# Altium schematic sheet I2C.SchDoc
size A; DocumentNumber: 1; SheetNumber: 1; SheetTotal: 1
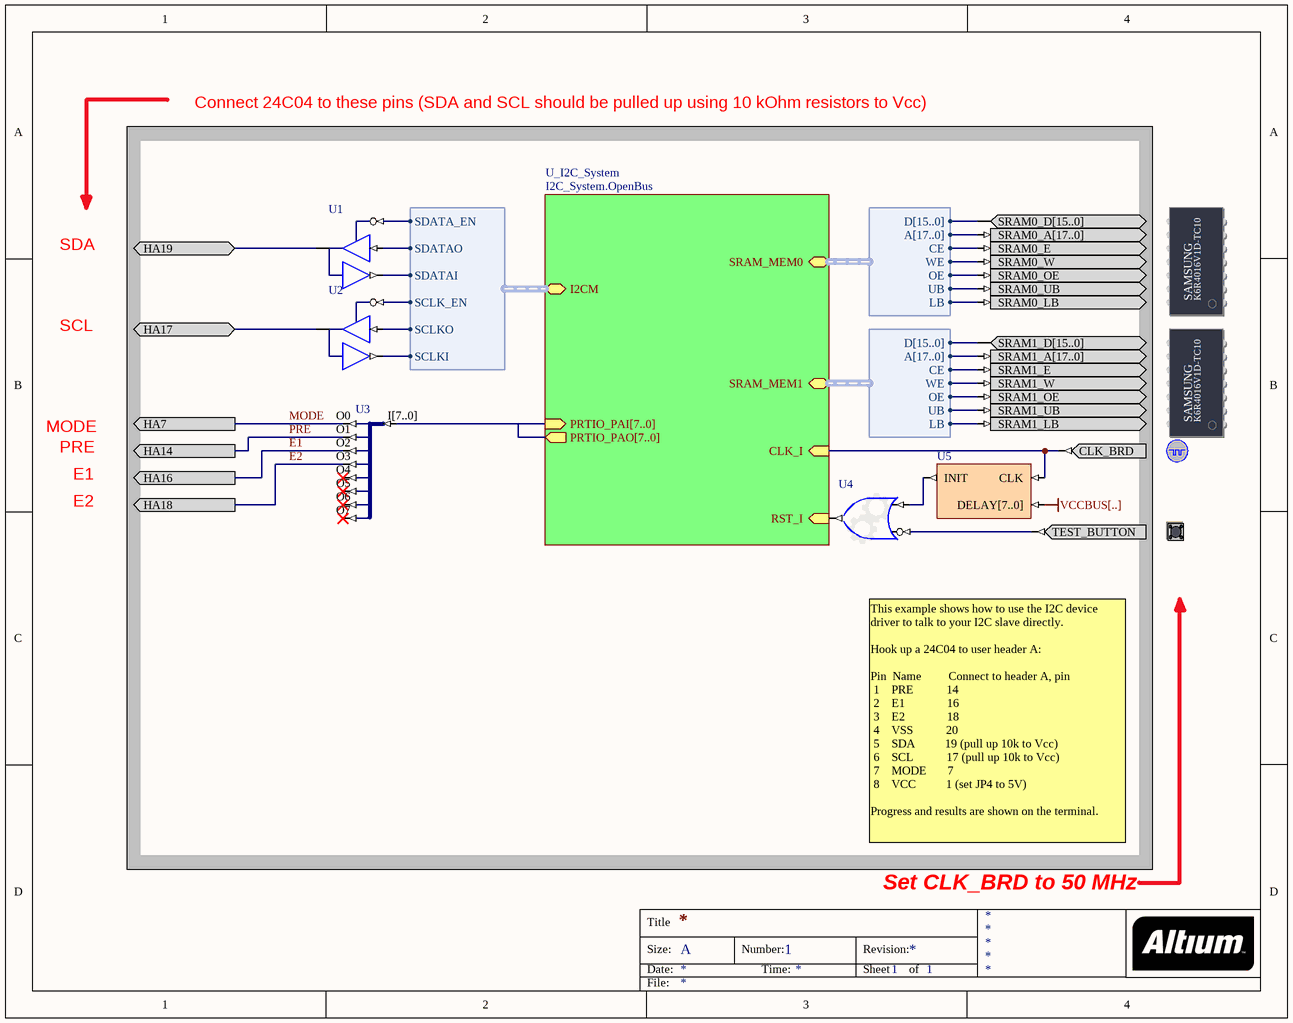
[diagram p0: I2C.SchDoc]

## Parts
(Parts that share a designator on the sheet are numbered #1, #2 ... from top to bottom, then left to right.)
?#1  SRAM_DAUGHTER0  (value not drawn)
?#2  SRAM_DAUGHTER1  (value not drawn)
?#3  CLOCK_BOARD  (value not drawn)
?#4  TEST_BUTTON  (value not drawn)
U1  IOBUF  (value not drawn)
U2  IOBUF  (value not drawn)
U3  J8B_8S  (value not drawn)
U4  OR2S  (value not drawn)
U5  FPGA_STARTUP8  (value not drawn)

## Sub-sheets
U_I2C_System = I2C_System.OpenBus: RST_I (in), CLK_I (in), PRTIO_PAO[7..0] (out), PRTIO_PAI[7..0] (in), SRAM_MEM0 (harness WB_MEM_CTRL_SRAM16_A18), SRAM_MEM1 (harness WB_MEM_CTRL_SRAM16_A18), I2CM (harness WB_I2CM)

## Ports
HA7 (out, see AF6), HA14 (out, see AF10), HA16 (out, see AF11), HA17 (bidir, see AE12), HA18 (out, see AF12), HA19 (bidir, see AF13)

## Harnesses
WB_MEM_CTRL_SRAM16_A18: D[15..0], A[17..0], CE, WE, OE, UB, LB
WB_I2CM: SDATA_EN, SDATAO, SDATAI, SCLK_EN, SCLKO, SCLKI

## Nets
VCCBUS[..]: U5.DELAY[7..0]
E1: U3.O2 ; port HA16
E2: U3.O3 ; port HA18
HA17: U2.IO ; port HA17
HA19: U1.IO ; port HA19
MODE: U3.O0 ; port HA7
PRE: U3.O1 ; port HA14
Net?#1_SRAM0_A[17..0]: ?#1.SRAM0_A[17..0] ; sheet U_I2C_System/SRAM_MEM0.A[17..0]
Net?#1_SRAM0_D[15..0]: ?#1.SRAM0_D[15..0] ; sheet U_I2C_System/SRAM_MEM0.D[15..0]
Net?#1_SRAM0_E: ?#1.SRAM0_E ; sheet U_I2C_System/SRAM_MEM0.CE
Net?#1_SRAM0_LB: ?#1.SRAM0_LB ; sheet U_I2C_System/SRAM_MEM0.LB
Net?#1_SRAM0_OE: ?#1.SRAM0_OE ; sheet U_I2C_System/SRAM_MEM0.OE
Net?#1_SRAM0_UB: ?#1.SRAM0_UB ; sheet U_I2C_System/SRAM_MEM0.UB
Net?#1_SRAM0_W: ?#1.SRAM0_W ; sheet U_I2C_System/SRAM_MEM0.WE
Net?#2_SRAM1_A[17..0]: ?#2.SRAM1_A[17..0] ; sheet U_I2C_System/SRAM_MEM1.A[17..0]
Net?#2_SRAM1_D[15..0]: ?#2.SRAM1_D[15..0] ; sheet U_I2C_System/SRAM_MEM1.D[15..0]
Net?#2_SRAM1_E: ?#2.SRAM1_E ; sheet U_I2C_System/SRAM_MEM1.CE
Net?#2_SRAM1_LB: ?#2.SRAM1_LB ; sheet U_I2C_System/SRAM_MEM1.LB
Net?#2_SRAM1_OE: ?#2.SRAM1_OE ; sheet U_I2C_System/SRAM_MEM1.OE
Net?#2_SRAM1_UB: ?#2.SRAM1_UB ; sheet U_I2C_System/SRAM_MEM1.UB
Net?#2_SRAM1_W: ?#2.SRAM1_W ; sheet U_I2C_System/SRAM_MEM1.WE
Net?#3_CLK_BRD: ?#3.CLK_BRD U5.CLK ; sheet U_I2C_System/CLK_I
Net?#4_TEST_BUTTON: ?#4.TEST_BUTTON U4.I1
NetU1_I: U1.I ; sheet U_I2C_System/I2CM.SDATAO
NetU1_O: U1.O ; sheet U_I2C_System/I2CM.SDATAI
NetU1_T: U1.T ; sheet U_I2C_System/I2CM.SDATA_EN
NetU2_I: U2.I ; sheet U_I2C_System/I2CM.SCLKO
NetU2_O: U2.O ; sheet U_I2C_System/I2CM.SCLKI
NetU2_T: U2.T ; sheet U_I2C_System/I2CM.SCLK_EN
NetU3_I[7..0]: U3.I[7..0] ; sheet U_I2C_System/PRTIO_PAO[7..0], sheet U_I2C_System/PRTIO_PAI[7..0]
NetU4_I0: U4.I0 U5.INIT
NetU4_O: U4.O ; sheet U_I2C_System/RST_I

Not connected (* = marked no-connect by the designer): U3 O4* O5* O6* O7*

## Buses and harness runs
bus sheet U_I2C_System/PRTIO_PAI[7..0] = sheet U_I2C_System/PRTIO_PAO[7..0]

## Notes on the sheet
- Connect 24C04 to these pins (SDA and SCL should be pulled up using 10 kOhm resistors to Vcc)
- SDA
- SCL
- MODE
- PRE
- E2
- E1
- This example shows how to use the I2C device driver to talk to your I2C slave directly.
  Hook up a 24C04 to user header A:
  Pin  Name         Connect to header A, pin
  1    PRE           14
  2    E1              16
  3    E2              18
  4    VSS           20
  5    SDA          19 (pull up 10k to Vcc)
  6    SCL           17 (pull up 10k to Vcc)
  7    MODE       7
  8    VCC          1 (set JP4 to 5V)
  Progress and results are shown on the terminal.
- Set CLK_BRD to 50 MHz
- Title
- Size:
- Date:
- A
- Number:
- Time:
- Revision:
- Sheet
- of
- File:
- (in symbol SRAM_DAUGHTER0) SAMSUNG; K6R4016V1D-TC10
- (in symbol SRAM_DAUGHTER1) SAMSUNG; K6R4016V1D-TC10

## Library data of the parts
?#1 = SRAM_DAUGHTER0: Free Static RAM - Daughterboard; PortComponent: True; Published: 14-May-2007; Publisher: Altium Limited; HelpURL: TR0149 Technical Reference for Altium's Xilinx Spartan-3 Daughter Board DB30.pdf#page=16
?#2 = SRAM_DAUGHTER1: Free Static RAM - Daughterboard; PortComponent: True; Published: 14-May-2007; Publisher: Altium Limited; HelpURL: TR0149 Technical Reference for Altium's Xilinx Spartan-3 Daughter Board DB30.pdf#page=16
?#3 = CLOCK_BOARD: Global System Clock Supply; PortComponent: True; Published: 19-Nov-2003; Publisher: Altium Limited; HelpURL: TR0143 Technical Reference Manual for Altium's Desktop NanoBoard NB2DSK01.pdf#page=41; UseInDSF: True
?#4 = TEST_BUTTON: Test / Reset Button; PortComponent: True; Published: 19-Nov-2003; Publisher: Altium Limited; HelpURL: TR0143 Technical Reference Manual for Altium's Desktop NanoBoard NB2DSK01.pdf#page=53
U1 U2 = IOBUF: Input/Output Buffer; Enable: Low; Control: Common Control T; ArchiveName: GENERIC; VHDLIB_SIM: GENERIC_LIB; Published: 29-Jan-2004; Publisher: Altium Limited; XilinxEquivalent: IOBUF; LastRevisionNo: 1.00.00; HelpURL: CR0118 FPGA Generic Library Guide.pdf#page=293; ComponentLink1URL: CR0125 FPGA Buffer Resource Usage.pdf#page=78; ComponentLink1Description: Core &Resource Usage; FunctionalClass: Buffer; SubClass: IOBUF
U3 = J8B_8S: 8-Bit input bus to 8 single pin outputs; FunctionalClass: Bus Joiner; PortSize: 8; ArchiveName: GENERIC; VHDLIB_SIM: GENERIC_LIB; Published: 29-Jan-2004; Publisher: Altium Limited; LastRevisionNo: 1.00.00; HelpURL: CR0118 FPGA Generic Library Guide.pdf#page=304; ComponentLink1URL: CR0126 FPGA Bus Joiner Resource Usage.pdf#page=27; ComponentLink1Description: Core &Resource Usage
U4 = GATE: Configurable Generic Gate; ConfiguratorName: GENERIC_GATE; ConfigurationParameters: {}Version[1.0]{}GateKind[OR]{}BusInput[False]{}GateInputType[Bit]{}GateOutputOption[Normal]{}BusWidth[8]{}RegisterOutputs[False]{}NegativeClockEdge[False]{}InputCount[2]{}InputInvert0[False]{}InputInvert1[True]{}; LastRevisionNo: 1.00.00; Published: 3-Sep-2008; Publisher: Altium Limited
U5 = FPGA_STARTUP8: FPGA Startup With 8 Bit Delay; Published: 9-Dec-2004; Publisher: Altium Limited; HelpURL: CR0119 FPGA_STARTUPx Powerup Delay Unit.pdf; LastRevisionNo: 1.00.00; ComponentLink1Description: Core &Resource Usage; ComponentLink1URL: CR0139 FPGA Peripheral Resource Usage.pdf#page=11